# Altium schematic sheet pca10156_sheet7_connectors.SchDoc: =BoardTitle+' - Connectors'
size A3; Organization: Nordic Semiconductor; DocumentNumber: 7; SheetNumber: 7; SheetTotal: 8; CompanyName: Nordic Semiconductor; DocumentSize: A4
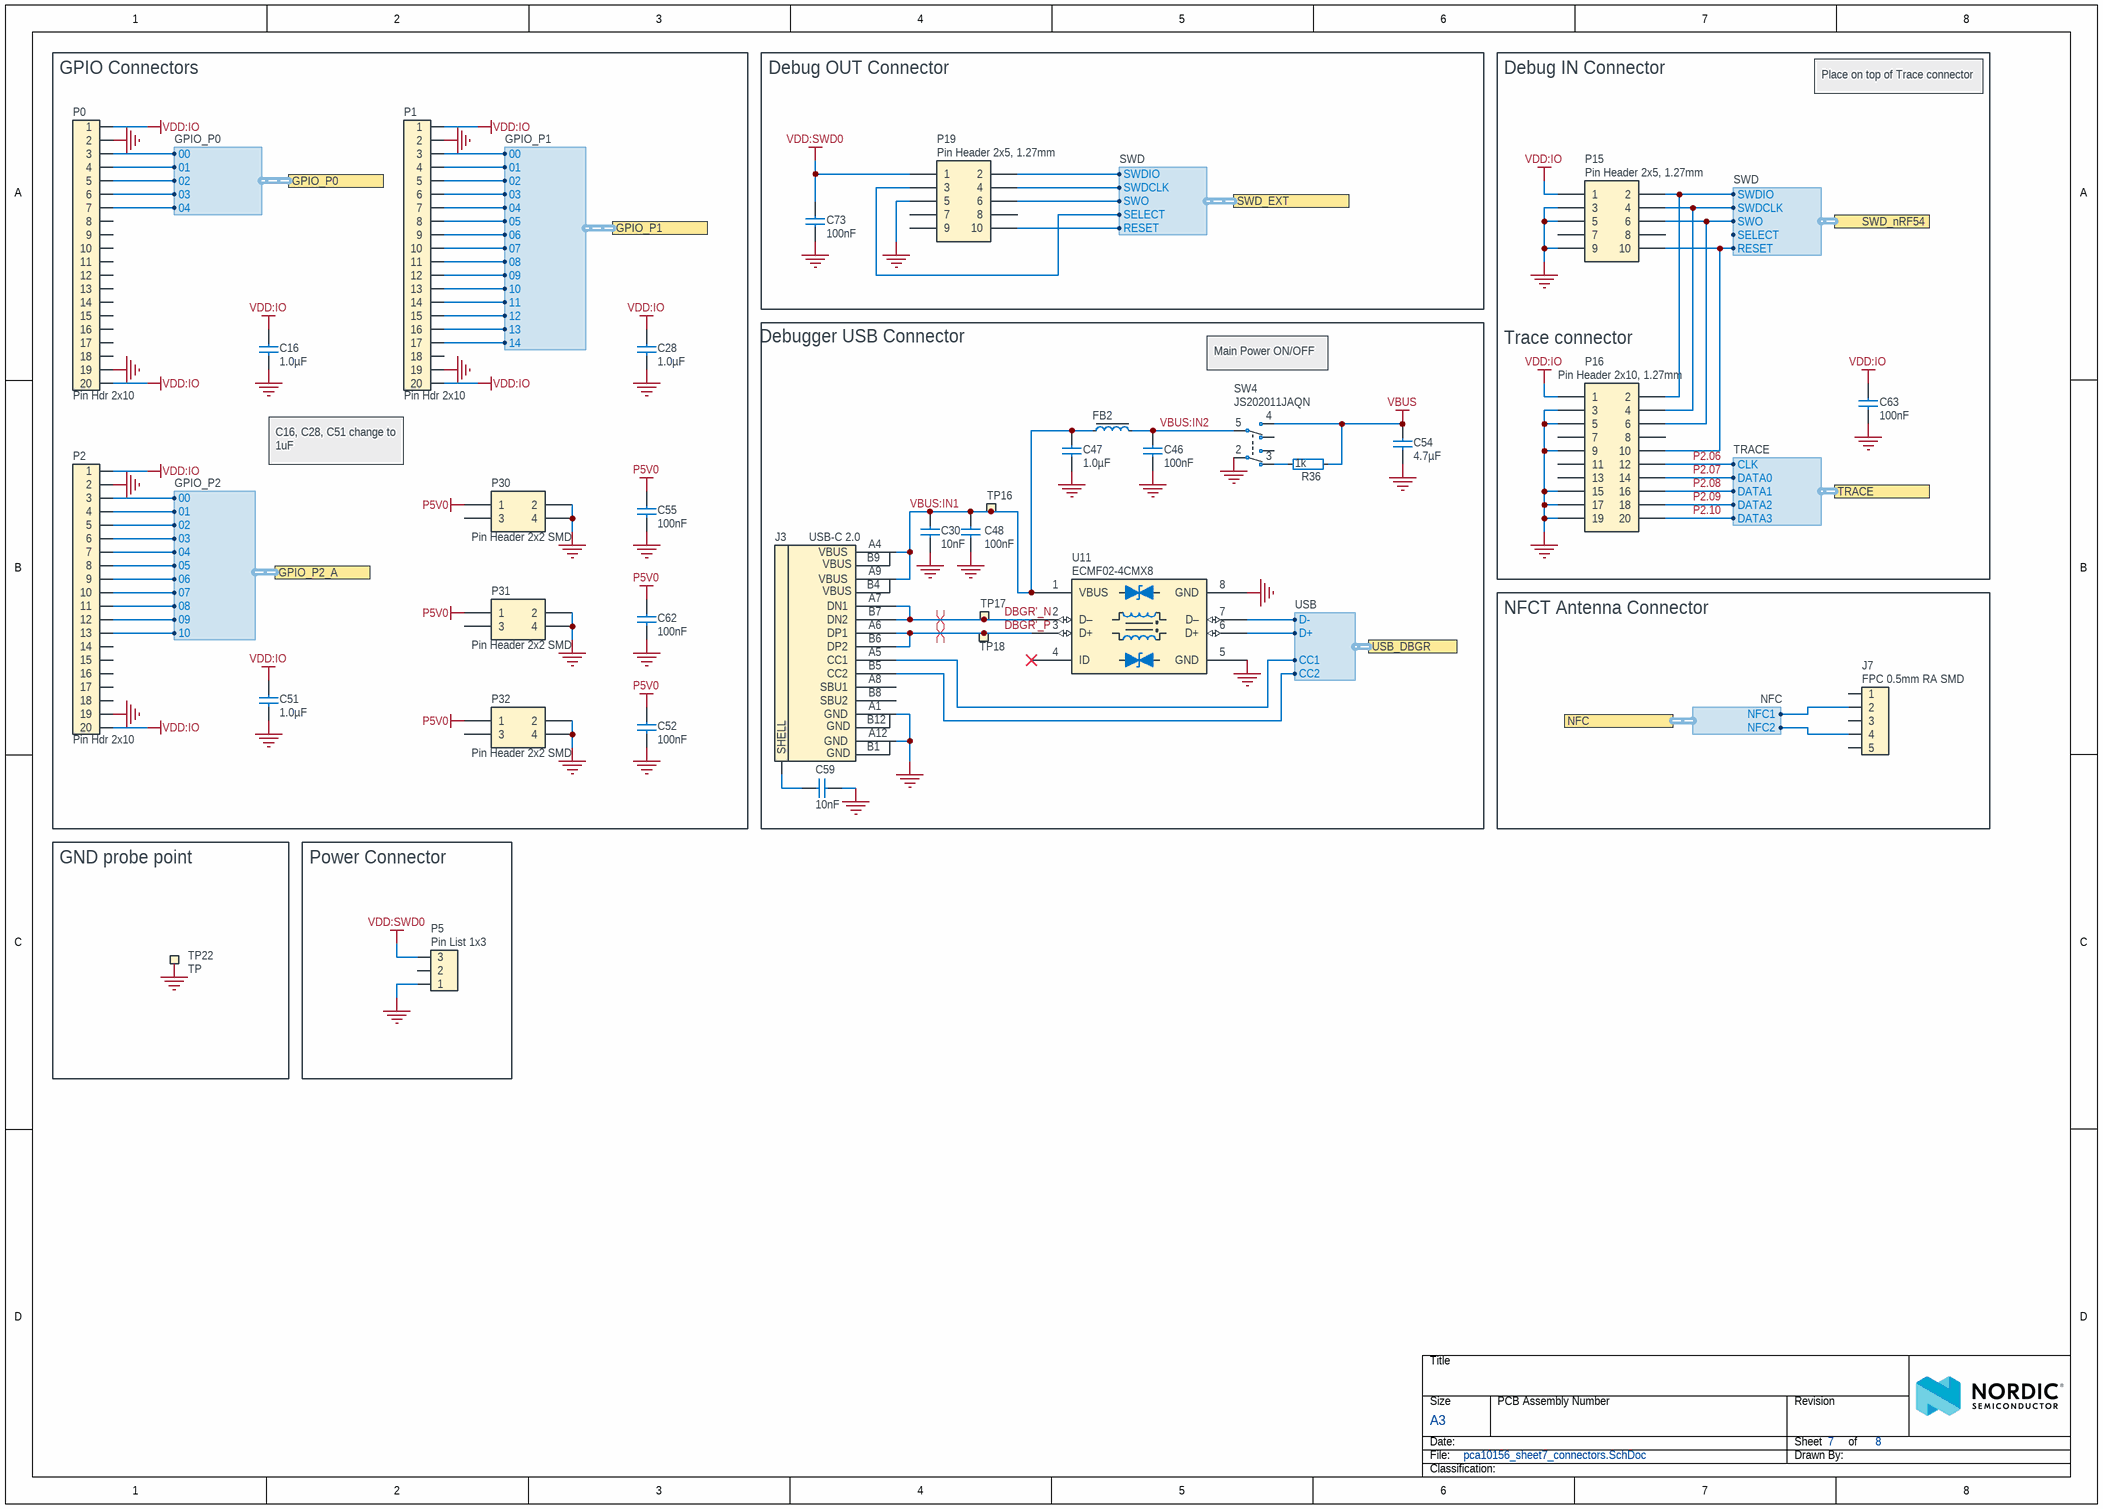
[diagram p0: pca10156_sheet7_connectors.SchDoc]

## Parts
C16  1.0µF  [CAPC1005X04L]
C28  1.0µF  [CAPC1005X04L]
C30  10nF  [CAPC0603X03L_C]
C46  100nF  [CAPC0603X03L_C]
C47  1.0µF  [CAPC1005X04L]
C48  100nF  [CAPC0603X03L_C]
C51  1.0µF  [CAPC1005X04L]
C52  100nF  [CAPC0603X03L_C]
C54  4.7µF  [CAPC1608X06L]
C55  100nF  [CAPC0603X03L_C]
C59  10nF  [CAPC1608X06L]
C62  100nF  [CAPC0603X03L_C]
C63  100nF  [CAPC0603X03L_C]
C73  100nF  [CAPC0603X03L_C]
FB2  120R/0.55A  [INDC1005X04L]  (value not drawn)
J3  USB-C 2.0  [SD-80259-001]
J7  FPC 0.5mm RA SMD  [FPC_05P-0.5mm-RA-SMD]
P0  Pin Hdr 2x10  [HDR_2x10-SMD]
P1  Pin Hdr 2x10  [HDR_2x10-SMD]
P2  Pin Hdr 2x10  [HDR_2x10-SMD]
P5  Pin List 1x3  [LIST_1x3_SMD]
P15  Pin Header 2x5, 1.27mm  [HDR_2x5-SMD-1.27mm-K]
P16  Pin Header 2x10, 1.27mm  [HDR_2x10-SMD-1.27mm-NC]
P19  Pin Header 2x5, 1.27mm  [HDR_2x5-SMD-1.27mm-K]
P30  Pin Header 2x2 SMD  [HDR_2x2-SMD]
P31  Pin Header 2x2 SMD  [HDR_2x2-SMD]
P32  Pin Header 2x2 SMD  [HDR_2x2-SMD]
R36  1k  [RESC0603X03L_C]
SW4  Manufacturer Part Number: JS202011JAQN  [JS102011JAQN]  (hidden comment: Switch)
TP16  Ø1.5mm,SMD  [TP_SMD_D1.5mm]  (value not drawn)  (no BOM)
TP17  Ø1.5mm,SMD  [TP_SMD_D1.5mm]  (value not drawn)  (no BOM)
TP18  Ø1.5mm,SMD  [TP_SMD_D1.5mm]  (value not drawn)  (no BOM)
TP22  TP  [S1751]
U11  ECMF02-4CMX8  [UFDFN50P120X250X55-8N]

## Blocks framed on the sheet
GPIO Connectors: C16 C28 C51 C52 C55 C62 P0-P2 P30-P32
Debug OUT Connector: C73 P19
Debugger USB Connector: C30 C46-C48 C54 C59 FB2 J3 R36 SW4 TP16-TP18 U11
NFCT Antenna Connector: J7
GND probe point: TP22
Power Connector: P5

## Ports
GPIO_P0 (harness GPIO_P0), GPIO_P1 (harness GPIO_P1), GPIO_P2_A (harness GPIO_P2), NFC (harness NFC), SWD_EXT (harness SWD), SWD_nRF54 (harness SWD), TRACE (harness TRACE), USB_DBGR (harness USB)

## Harnesses
USB: D+, D-, CC1, CC2
SWD: SWDIO, SWDCLK, SWO, RESET, SELECT
NFC: NFC2, NFC1
GPIO_P1: 00, 01, 02, 03, 04, 05, 06, 07, 08, 09, 10, 11, 12, 13, 14
GPIO_P2: 00, 01, 02, 03, 04, 05, 06, 07, 08, 09, 10
TRACE: CLK, DATA0, DATA1, DATA3, DATA2
GPIO_P0: 02, 03, 04, 00, 01

## Nets
GND: C16.1 C28.1 C30.2 C46.1 C47.1 C48.1 C51.1 C52.1 C54.2 C55.1 C59.2 C62.1 C63.1 C73.1 J3.A1(GND) J3.A12(GND) P0.2 P0.19 P1.2 P1.19 P2.2 P2.19 P5.1 P15.3 P15.5 P15.9 P16.3 P16.5 P16.9 P16.15 P16.17 P16.19 P19.5 P30.2 P30.4 P31.2 P31.4 P32.2 P32.4 SW4.2(COM-1) TP22.1 U11.5(GND) U11.8(GND)
P5V0: C52.2 C55.2 C62.2 P30.1 P31.1 P32.1
VBUS: C54.1 R36.2 SW4.4(N.O-2)
VDD:IO: C16.2 C28.2 C51.2 C63.2 P0.1 P0.20 P1.1 P1.20 P2.1 P2.20 P15.1 P16.1
VDD:SWD0: C73.2 P5.3 P19.1
DBGR'_N: J3.A7(DN1) J3.B7(DN2) TP17.1 U11.2(D–)
DBGR'_P: J3.A6(DP1) J3.B6(DP2) TP18.1 U11.3(D+)
P2.06: P16.12 ; port TRACE.CLK
P2.07: P16.14 ; port TRACE.DATA0
P2.08: P16.16 ; port TRACE.DATA1
P2.09: P16.18 ; port TRACE.DATA2
P2.10: P16.20 ; port TRACE.DATA3
VBUS:IN1: C30.1 C47.2 C48.2 FB2.1 J3.A4(VBUS) J3.A9(VBUS) TP16.1 U11.1(VBUS)
VBUS:IN2: C46.2 FB2.2 SW4.5(COM-2)
NetC59_1: C59.1 J3.SHLD(SHELL)
NetJ3_A5: J3.A5(CC1) ; port USB_DBGR.CC1
NetJ3_B5: J3.B5(CC2) ; port USB_DBGR.CC2
NetJ7_2: J7.2 ; port NFC.NFC1
NetJ7_4: J7.4 ; port NFC.NFC2
NetP0_3: P0.3 ; port GPIO_P0.00
NetP0_4: P0.4 ; port GPIO_P0.01
NetP0_5: P0.5 ; port GPIO_P0.02
NetP0_6: P0.6 ; port GPIO_P0.03
NetP0_7: P0.7 ; port GPIO_P0.04
NetP1_3: P1.3 ; port GPIO_P1.00
NetP1_4: P1.4 ; port GPIO_P1.01
NetP1_5: P1.5 ; port GPIO_P1.02
NetP1_6: P1.6 ; port GPIO_P1.03
NetP1_7: P1.7 ; port GPIO_P1.04
NetP1_8: P1.8 ; port GPIO_P1.05
NetP1_9: P1.9 ; port GPIO_P1.06
NetP1_10: P1.10 ; port GPIO_P1.07
NetP1_11: P1.11 ; port GPIO_P1.08
NetP1_12: P1.12 ; port GPIO_P1.09
NetP1_13: P1.13 ; port GPIO_P1.10
NetP1_14: P1.14 ; port GPIO_P1.11
NetP1_15: P1.15 ; port GPIO_P1.12
NetP1_16: P1.16 ; port GPIO_P1.13
NetP1_17: P1.17 ; port GPIO_P1.14
NetP2_3: P2.3 ; port GPIO_P2_A.00
NetP2_4: P2.4 ; port GPIO_P2_A.01
NetP2_5: P2.5 ; port GPIO_P2_A.02
NetP2_6: P2.6 ; port GPIO_P2_A.03
NetP2_7: P2.7 ; port GPIO_P2_A.04
NetP2_8: P2.8 ; port GPIO_P2_A.05
NetP2_9: P2.9 ; port GPIO_P2_A.06
NetP2_10: P2.10 ; port GPIO_P2_A.07
NetP2_11: P2.11 ; port GPIO_P2_A.08
NetP2_12: P2.12 ; port GPIO_P2_A.09
NetP2_13: P2.13 ; port GPIO_P2_A.10
NetP15_2: P15.2 P16.2 ; port SWD_nRF54.SWDIO
NetP15_4: P15.4 P16.4 ; port SWD_nRF54.SWDCLK
NetP15_6: P15.6 P16.6 ; port SWD_nRF54.SWO
NetP15_10: P15.10 P16.10 ; port SWD_nRF54.RESET
NetP19_2: P19.2 ; port SWD_EXT.SWDIO
NetP19_3: P19.3 ; port SWD_EXT.SELECT
NetP19_4: P19.4 ; port SWD_EXT.SWDCLK
NetP19_6: P19.6 ; port SWD_EXT.SWO
NetP19_10: P19.10 ; port SWD_EXT.RESET
NetR36_1: R36.1 SW4.3(N.C-1)
NetU11_6: U11.6(D+) ; port USB_DBGR.D+
NetU11_7: U11.7(D–) ; port USB_DBGR.D-

Not connected (* = marked no-connect by the designer): J3 A8(SBU1) B8(SBU2); J7 1 3 5; P0 8 9 10 11 12 13 14 15 16 17 18; P1 18; P2 14 15 16 17 18; P5 2; P15 7 8; P16 7 8 11 13; P19 7 8 9; P30 3; P31 3; P32 3; SW4 1(N.O-1) 6(N.C-2); U11 4(ID)*

## Layout directives
differential pair; differential pair class DBGR; net class DBGR_USB: DBGR'_N, DBGR'_P

## Notes on the sheet
- Debug IN Connector
- Place on top of Trace connector
- Main Power ON/OFF
- (near P16) Trace connector
- C16, C28, C51 change to 1uF
- Title
- Size
- Date:
- File:
- A3
- PCB Assembly Number
- Sheet
- Drawn By:
- Revision
- of
- Classification:
- (in symbol SD-80259-1021) B9; B4; B12; B1

## Library data of the parts
C16 C28 C51 = C0402-1µ0-6.3V-X5R-10%: Capacitor, X5R, ±10%, 6.3V; Manufacturer: N.A.; Part number Norautron: 26207137; Part number NEMS: 100200498; Pad Count: 2; Component Status: Active; Part Number: C0402-1µ0-6.3V-X5R-10%; Manufacturer Part Number: N.A.; LatestRevisionDate: 2022-01-27; Published: 2022-01-27; Value: 1.0µF; Note: 6.3V; Artikkelnr Noca: N.A.; Footprint Doc: 0402; Part number IPS: N.A.; ComponentLink1URL: N.A.; ComponentLink1Description: Datasheet; ComponentLink2URL: N.A.; ComponentLink2Description: Supplier link; HelpURL: N.A.; Supplier 1: N.A.; Supplier Part Number 1: N.A.; Supplier 2: N.A.; Supplier Part Number 2: N.A.; Component Class: Capacitors; PartId: 100200498; Author: rubr
C30 = C0201-10n: Capacitor, X7R, ±10%; Manufacturer: N.A.; Part number IPS: 00000003480; Part number Norautron: 26621779; Part number NEMS: 100200067; Note: 10V; Pad Count: 2; Component Status: Active; Part Number: C0201-10n; Manufacturer Part Number: N.A.; LatestRevisionDate: 2017-11-09; Published: 2014-11-13; Value: 10nF; Artikkelnr Noca: N.A.; Footprint Doc: 0201; ComponentLink1URL: N.A.; ComponentLink1Description: Datasheet; ComponentLink2URL: N.A.; ComponentLink2Description: Supplier link; HelpURL: N.A.; Supplier 1: N.A.; Supplier Part Number 1: N.A.; Supplier 2: N.A.; Supplier Part Number 2: N.A.; Component Class: Capacitors; PartId: 100200067; Author: rsk
C46 C48 C52 C55 C62 C63 C73 = C0201-100n: Capacitor, X5R, ±10%; Manufacturer: N.A.; Part number IPS: 00000001248, 00000002505; Part number Norautron: 262071862; Part number NEMS: 100200078; Note: 16V; Pad Count: 2; Component Status: Active; Part Number: C0201-100n; Manufacturer Part Number: N.A.; LatestRevisionDate: 2017-11-09; Published: 2014-11-13; Value: 100nF; Artikkelnr Noca: N.A.; Footprint Doc: 0201; ComponentLink1URL: N.A.; ComponentLink1Description: Datasheet; ComponentLink2URL: N.A.; ComponentLink2Description: Supplier link; HelpURL: N.A.; Supplier 1: N.A.; Supplier Part Number 1: N.A.; Supplier 2: N.A.; Supplier Part Number 2: N.A.; Component Class: Capacitors; PartId: 100200078; Author: rsk
C47 = C0402-1µ0-16V-X5R: Capacitor, Ceramic, X5R, ±10%, 16V; Manufacturer: Murata; Manufacturer Part Number: GRT155R61C105KE01D; Part number NEMS: 100200452; Component Status: Active; Pad Count: 2; Artikkelnr Noca: N.A.; Part Number: C0402-1µ0-16V-X5R; PartId: 100200452; Component Class: Capacitors; Author: rsk; ComponentLink1URL: https://search.murata.co.jp/Ceramy/image/img/A01X/G101/ENG/GRT155R61C105KE01-01.pdf; ComponentLink1Description: Datasheet; ComponentLink2URL: https://www.murata.com/en-global/products/productdetail?partno=GRT155R61C105KE01%23; ComponentLink2Description: Supplier link; HelpURL: N.A.; LatestRevisionDate: 2020-12-15; Published: 2020-12-15; Footprint Doc: 0402; Value: 1.0µF; Note: 16V; Supplier 1: Digi-Key; Supplier Part Number 1: 490-12255-1-ND; Supplier 2: Mouser; Supplier Part Number 2: 81-GRT155R61C105KE1D; Part number IPS: N.A.; Part number Norautron: N.A.
C54 = C0603-4µ7-10V-X7S: Capacitor, X7S, ±10%, 10V; Manufacturer: N.A.; Part number IPS: 00000001779; Part number NEMS: 100200351; Pad Count: 2; Artikkelnr Noca: 20030013; Component Status: Active; Part Number: C0603-4µ7-10V-X7S; Value: 4.7µF; Footprint Doc: 0603; Component Class: Capacitors; Author: rsk; PartId: 100200351; Manufacturer Part Number: N.A.; ComponentLink1URL: N.A.; ComponentLink1Description: Datasheet; ComponentLink2URL: N.A.; ComponentLink2Description: Supplier link; HelpURL: N.A.; LatestRevisionDate: 2016-08-15; Published: 2016-08-15; Note: 10V; Supplier 1: Digi-Key; Supplier Part Number 1: 445-14258-1-ND; Supplier 2: N.A.; Supplier Part Number 2: N.A.; Part number Norautron: N.A.
C59 = C0603-10n-100V-X7R: Capacitor, X7R, ±10%, 100V; Manufacturer: Murata; Manufacturer Part Number: GCM188R72A103KA37D; Part number NEMS: 100200349; Component Status: Active; Pad Count: 2; Artikkelnr Noca: N.A.; Part Number: C0603-10n-100V-X7R; PartId: 100200349; Component Class: Capacitors; Author: rsk; ComponentLink1URL: N.A.; ComponentLink1Description: Datasheet; ComponentLink2URL: N.A.; ComponentLink2Description: Supplier link; HelpURL: http://psearch.en.murata.com/capacitor/product/GCM188R72A103KA37%23.pdf; LatestRevisionDate: 2017-08-22; Published: 2017-08-22; Footprint Doc: 0603; Value: 10nF; Note: 100V; Supplier 1: Digi-Key; Supplier Part Number 1: 490-4781-1-ND; Supplier 2: N.A.; Supplier Part Number 2: N.A.; Part number IPS: N.A.; Part number Norautron: N.A.
FB2 = FB0402-120R@100M-500mA: Ferrite Bead, 120 Ohm @ 100MHz, 500mA, 250 mOhm Max; Manufacturer: Murata; Manufacturer Part Number: BLM15AG121SN1D; Part number IPS: 00000009954; Part number Norautron: 265230631; Part number NEMS: 100300099; Note: Chip EMIFIL Inductor Type Chip Ferrite Bead; Artikkelnr Noca: 33029317; Pad Count: 2; Component Status: Active; Part Number: FB0402-120R@100M-500mA; Footprint Doc: 0402; LatestRevisionDate: 2014-01-10; Published: 2011-11-14; Value: 120R/0.55A; ComponentLink1Description: Datasheet; ComponentLink2Description: Supplier link; ComponentLink1URL: N.A.; ComponentLink2URL: N.A.; HelpURL: http://search.murata.co.jp/Ceramy/image/img/PDF/ENG/L0110S0100BLM15A_SN.pdf; Supplier 1: Digi-Key; Supplier Part Number 1: 490-1005-1-ND; Supplier 2: Farnell; Supplier Part Number 2: 151-5760; Component Class: Inductors; PartId: 100300099; Author: rsk
J3 = SD-80259-1021: USB-C Receptacle, 16 Pin, USB 2.0; Manufacturer: Bellweather Electronic Corp.; Part number NEMS: 100500830; Component Status: Active; Pad Count: 16; Note: N.A.; System: Connector; Part Number: SD-80259-1021; PartId: 100500830; Component Class: Connectors; Author: getr; Manufacturer Part Number: SD-80259-1021; ComponentLink1URL: \\hizz\pro\app9717\Datasheet\connectors\Bellwether\SD-80259-001_C.pdf; ComponentLink1Description: Datasheet; ComponentLink2URL: N.A.; ComponentLink2Description: Supplier link; HelpURL: N.A.; LatestRevisionDate: 2023-10-30; Published: 2023-10-30; Footprint Doc: SD-80259-001; Value: USB-C 2.0; Supplier 1: Cabcon; Supplier Part Number 1: SD-80259-1021; Supplier 2: N.A.; Supplier Part Number 2: N.A.; Artikkelnr Noca: N.A.; Part number IPS: N.A.; Part number Norautron: N.A.
J7 = FPC_05P-0.5mm-RA-SMD: 0.5mm FPC, 5P,Right Angle SMT,Double Contact,H=1.2mm,White, Tin plated; Manufacturer: WCON; Manufacturer Part Number: 5141-05RZDNWR03; Part number NEMS: 100500528; Note: (Replaced 5141-05RZDNWR02); Artikkelnr Noca: N.A.; Pad Count: 7; Component Status: Active; System: Connector; Part Number: FPC_05P-0.5mm-RA-SMD; Footprint Doc: FPC_05P-0.5mm-RA-SMD; LatestRevisionDate: 2024-02-02; Published: 2015-06-22; Value: FPC 0.5mm RA SMD; Part number IPS: N.A.; ComponentLink1URL: N.A.; ComponentLink1Description: Datasheet; ComponentLink2URL: N.A.; ComponentLink2Description: Supplier link; HelpURL: \\hizz\pro\app9717\Datasheet\connectors\W-CON\5141-05RZDNXX02.pdf; Supplier 1: Cabcon; Supplier Part Number 1: 5141-05RZDNWR03; Supplier 2: N.A.; Supplier Part Number 2: N.A.; Component Class: Connectors; PartId: 100500528; Author: rsk; Part number Norautron: N.A.
P0-P2 = Pin Header 2x10 SMD, 2.54mm: Pin Header 2x10, 2.54mm (100mil) SMD; Manufacturer: WCON; Manufacturer Part Number: 1125-1210S0M116CR09; Part number NEMS: 100500738; Pad Count: 20; Artikkelnr Noca: N.A.; Component Status: Active; System: Connector; Part Number: Pin Header 2x10 SMD, 2.54mm; Component Class: Connectors; Author: stl1; ComponentLink1URL: https://suddendocs.samtec.com/catalog_english/tsm.pdf; ComponentLink1Description: Datasheet; ComponentLink2URL: https://www.digikey.no/en/products/detail/samtec-inc/TSM-110-02-S-DV/6679037; ComponentLink2Description: Supplier link; HelpURL: https://www.samtec.com/products/tsm-110-02-s-dv; Footprint Doc: HDR_2x10-SMD-2.54MM; LatestRevisionDate: 2024-02-21; Published: 2022-01-24; Note: SMD; Supplier 1: Cabcon; Supplier Part Number 1: 1125-1210S0M116CR09; Supplier 2: Samtec; Supplier Part Number 2: TSM-110-02-S-DV; Part number IPS: N.A.; Part number Norautron: N.A.; PartId: 100500738
  P0 P1: Value: Pin Hdr 2x10
  P2: VALUE: Pin Hdr 2x10
P5 = Pin List 1x3 SMD: Pin List 1x3, 2.54mm (100mil), SMD; Manufacturer: WCON; Manufacturer Part Number: 1125-1103S0M116CR04; Part number Norautron: 26470016; Part number NEMS: 100500306; Note: N.A.; Pad Count: 3; Component Status: Active; System: Connector; Part Number: Pin List 1x3 SMD; Footprint Doc: LIST_1x3_SMD; LatestRevisionDate: 2021-09-24; Published: 2013-10-21; Value: Pin List 1x3; Artikkelnr Noca: N.A.; ComponentLink1URL: N.A.; ComponentLink1Description: Datasheet; ComponentLink2URL: N.A.; ComponentLink2Description: Supplier link; HelpURL: N.A.; Part number IPS: N.A.; Supplier 1: Cabcon; Supplier Part Number 1: 1125-1103S0M116CR04; Supplier 2: Samtec; Supplier Part Number 2: TSM-103-01-L-SV-P-TR; Component Class: Connectors; PartId: 100500306; Author: rsk
P15 P19 = Pin Header 2x5 SMD, 1.27mm, KS: Pin Header 2x5, 1.27mm (50mil), SMD, Keying Shroud; Manufacturer: WCON; Manufacturer Part Number: 3132-10MS0BK00R5; Part number NEMS: 100500261; Note: (Replaced 3132-10MS0BK00R1); Artikkelnr Noca: N.A.; Pad Count: 10; Component Status: Active; System: Connector; Part Number: Pin Header 2x5 SMD, 1.27mm, KS; Footprint Doc: HDR_2x5-SMD-1.27mm; LatestRevisionDate: 2024-02-02; Published: 2016-01-22; Value: Pin Header 2x5, 1.27mm; Part number IPS: N.A.; ComponentLink1URL: N.A.; ComponentLink1Description: Datasheet; ComponentLink2URL: N.A.; ComponentLink2Description: Supplier link; HelpURL: \\hizz\pro\app9717\Datasheet\connectors\W-CON\3132-XXMXXBK00XX.pdf; Supplier 1: Cabcon; Supplier Part Number 1: 3132-10MS0BK00R5; Supplier 2: N.A.; Supplier Part Number 2: N.A.; Component Class: Connectors; PartId: 100500261; Author: rsk; Part number Norautron: N.A.
P16 = Pin Header 2x10 SMD, 1.27mm, KS, N.C.: Pin Header 2x10, 1.27mm (50mil), SMD, Keying Shroud; Manufacturer: WCON; Manufacturer Part Number: 3132-20MS0BK00R1; Part number NEMS: 100500279; Note: N.A.; Pad Count: 20; Component Status: Active; System: Connector; Part Number: Pin Header 2x10 SMD, 1.27mm, KS, N.C.; LatestRevisionDate: 2017-10-23; Published: 2017-09-07; VALUE: Pin Header 2x10, 1.27mm; Artikkelnr Noca: N.A.; Footprint Doc: HDR_2x10-SMD-1.27mm; Part number IPS: N.A.; ComponentLink1URL: N.A.; ComponentLink1Description: Datasheet; ComponentLink2URL: N.A.; ComponentLink2Description: Supplier link; HelpURL: N.A.; Supplier 1: Cabcon; Supplier Part Number 1: 3132-20MS0BK00R1; Supplier 2: Digi-Key; Supplier Part Number 2: FTSH-110-01-F-DV-K-ND; Component Class: Connectors; PartId: 100500279; Author: rsk; Part number Norautron: N.A.
P30-P32 = Pin Header 2x2 SMD: Pin Header 2x2, SMD, 2.54mm (100mil); Manufacturer: WCON; Manufacturer Part Number: 1125-1202S0M116CR03; Part number NEMS: 100500770; Component Status: Active; Pad Count: 4; Note: N.A.; System: Connector; Part Number: Pin Header 2x2 SMD; PartId: 100500770; Component Class: Connectors; Author: stl1; ComponentLink1URL: N.A.; ComponentLink1Description: Datasheet; ComponentLink2URL: N.A.; ComponentLink2Description: Supplier link; HelpURL: N.A.; LatestRevisionDate: 2024-02-21; Published: 2022-10-28; Footprint Doc: HDR_2x2-SMD; Value: Pin Header 2x2 SMD; Supplier 1: Cabcon; Supplier Part Number 1: 1125-1202S0M116CR03; Supplier 2: Samtec; Supplier Part Number 2: TSM-102-02-S-DV; Artikkelnr Noca: N.A.; Part number IPS: N.A.; Part number Norautron: N.A.
R36 = R0201-1k0: Resistor, ±1%, 0.05W; Manufacturer: N.A.; Part number IPS: 00000005786; Part number NEMS: 100100043; Component Status: Active; Pad Count: 2; Note: Chip Res 1%; Part Number: R0201-1k0; PartId: 100100043; Component Class: Resistors; Author: rsk; Manufacturer Part Number: N.A.; ComponentLink1URL: N.A.; ComponentLink1Description: Datasheet; ComponentLink2URL: N.A.; ComponentLink2Description: Supplier link; HelpURL: N.A.; LatestRevisionDate: 2014-11-13; Published: 2014-11-13; Footprint Doc: 0201; Value: 1k; Supplier 1: N.A.; Supplier Part Number 1: N.A.; Supplier 2: N.A.; Supplier Part Number 2: N.A.; Artikkelnr Noca: N.A.; Part number Norautron: N.A.
SW4 = Switch-Slide-RA-J-Lead-DPDT-8.5x3.5mm_C&K: SMD slide Switch (ON-ON); Manufacturer: C&K; Part number IPS: 00000007811; Part number NEMS: 101500037; Component Status: Active; Pad Count: 6; Note: N.A.; Part Number: Switch-Slide-RA-J-Lead-DPDT-8.5x3.5mm_C&K; PartId: 101500037; Component Class: Switches; Author: rsk; ComponentLink1URL: N.A.; ComponentLink1Description: Datasheet; ComponentLink2URL: N.A.; ComponentLink2Description: Supplier link; HelpURL: http://www.ck-components.com/media/1422/js.pdf; LatestRevisionDate: 2017-02-01; Published: 2016-09-15; Footprint Doc: Switch-Slide-RA-J-Lead-DPDT-8.5x3.5mm; Value: Switch; Supplier 1: Digi-Key; Supplier Part Number 1: CKN10722CT-ND; Supplier 2: Mouser; Supplier Part Number 2: 611-JS202011JAQN; Artikkelnr Noca: N.A.; Part number Norautron: N.A.
TP16-TP18 = TP_SMD_Ø1.5MM: 1.5mm circular SMD testpad; Manufacturer: Nordic Semiconductor; Manufacturer Part Number: N.A.; Part number NEMS: 100500477; Pad Count: 1; Component Status: Active; Part Number: TP_SMD_Ø1.5MM; LatestRevisionDate: 2021-03-05; Published: 2016-06-02; Value: Ø1.5mm,SMD; Note: N.A.; Artikkelnr Noca: N.A.; Footprint Doc: TP_SMD_Ø1.5mm; Part number IPS: N.A.; ComponentLink1URL: N.A.; ComponentLink1Description: Datasheet; ComponentLink2URL: N.A.; ComponentLink2Description: Supplier link; HelpURL: N.A.; Supplier 1: N.A.; Supplier Part Number 1: N.A.; Supplier 2: N.A.; Supplier Part Number 2: N.A.; Component Class: Connectors; PartId: 100500477; Author: rsk; Part number Norautron: N.A.
TP22 = TP - S1751-46R: PC TEST POINT TIN SMD L; Manufacturer: Harwin; Part number NEMS: 100500525; Component Status: Active; Pad Count: 1; Note: N.A.; Part Number: TP - S1751-46R; PartId: 100500525; Component Class: Connectors; Author: rsk; Manufacturer Part Number: S1751-46R; ComponentLink1URL: N.A.; ComponentLink1Description: Datasheet; ComponentLink2URL: N.A.; ComponentLink2Description: Supplier link; HelpURL: http://cdn.harwin.com/pdfs/S1751.pdf; LatestRevisionDate: 2015-05-29; Published: 2015-05-29; Footprint Doc: Harwin S1751-46R; Value: TP; Supplier 1: Digi-Key; Supplier Part Number 1: 952-1478-1-ND; Supplier 2: N.A.; Supplier Part Number 2: N.A.; Artikkelnr Noca: N.A.; Part number IPS: N.A.; Part number Norautron: N.A.
U11 = ECMF02-4CMX8: 2 Line Common mode filter with ESD protection for USB 2.0 interface; Manufacturer: STMicroelectronics; Part number NEMS: 100800034; Component Status: Active; Pad Count: 8; Note: N.A.; Part Number: ECMF02-4CMX8; PartId: 100800034; Component Class: Filters; Author: eisk; Manufacturer Part Number: ECMF02-4CMX8; ComponentLink1URL: https://www.st.com/content/ccc/resource/technical/document/datasheet/group3/1c/93/cf/72/85/cf/4d/d6/DM00039389/files/DM00039389.pdf/jcr:content/translations/en.DM00039389.pdf; ComponentLink1Description: Datasheet; ComponentLink2URL: https://www.digikey.com/en/products/detail/stmicroelectronics/ECMF02-4CMX8/3770020; ComponentLink2Description: Supplier link; HelpURL: https://www.st.com/content/ccc/resource/technical/document/datasheet/group3/1c/93/cf/72/85/cf/4d/d6/DM00039389/files/DM00039389.pdf/jcr:content/translations/en.DM00039389.pdf; LatestRevisionDate: 2024-01-31; Published: 2024-01-31; Footprint Doc: UFDFN-8; Value: ECMF02-4CMX8; Supplier 1: Digi-Key; Supplier Part Number 1: 497-13420-2-ND; Supplier 2: Mouser; Supplier Part Number 2: 511-ECMF02-4CMX8; Artikkelnr Noca: N.A.; Part number IPS: N.A.; Part number Norautron: N.A.